# Altium schematic sheet parent.SchDoc
size A4; SheetNumber: 1; SheetTotal: 6
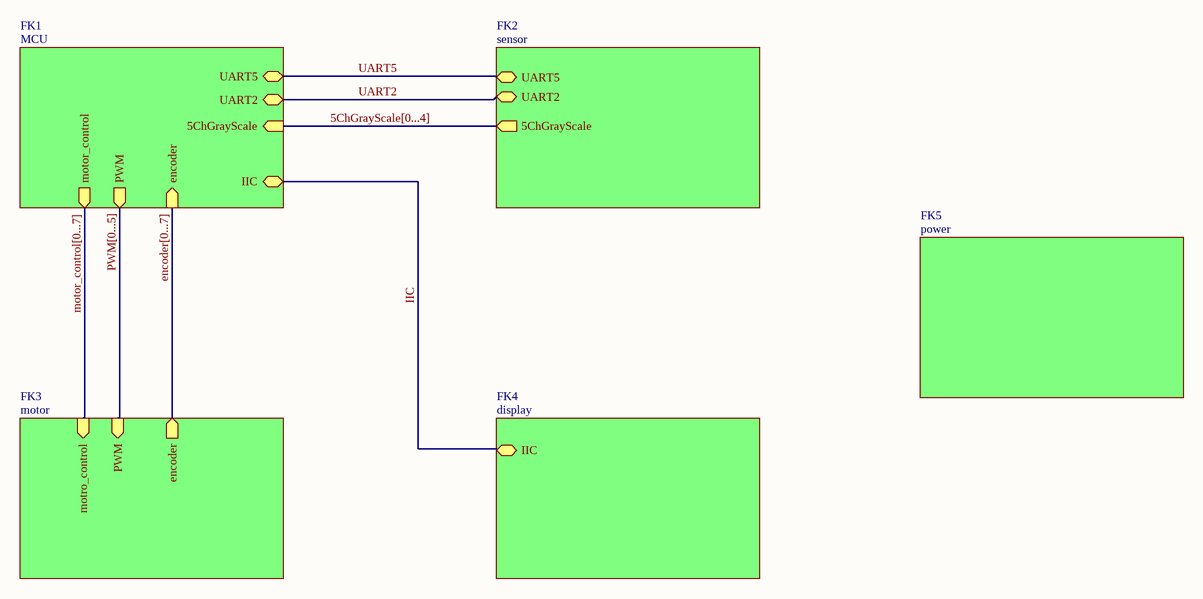
[diagram p0: parent.SchDoc]

## Sub-sheets
FK1 = MCU: UART2 (bidir), UART5 (bidir), IIC (bidir), motor_control (out), PWM (out), 5ChGrayScale (in), encoder (in)
FK2 = sensor: 5ChGrayScale (out), UART2 (bidir), UART5 (bidir)
FK3 = motor: motro_control (in), PWM (in), encoder (out)
FK4 = display: IIC (bidir)
FK5 = power: no entries

## Nets
5ChGrayScale[0...4]: sheet FK1/5ChGrayScale, sheet FK2/5ChGrayScale
encoder[0...7]: sheet FK1/encoder, sheet FK3/encoder
IIC: sheet FK1/IIC, sheet FK4/IIC
motor_control[0...7]: sheet FK1/motor_control, sheet FK3/motro_control
PWM[0...5]: sheet FK1/PWM, sheet FK3/PWM
UART2: sheet FK1/UART2, sheet FK2/UART2
UART5: sheet FK1/UART5, sheet FK2/UART5